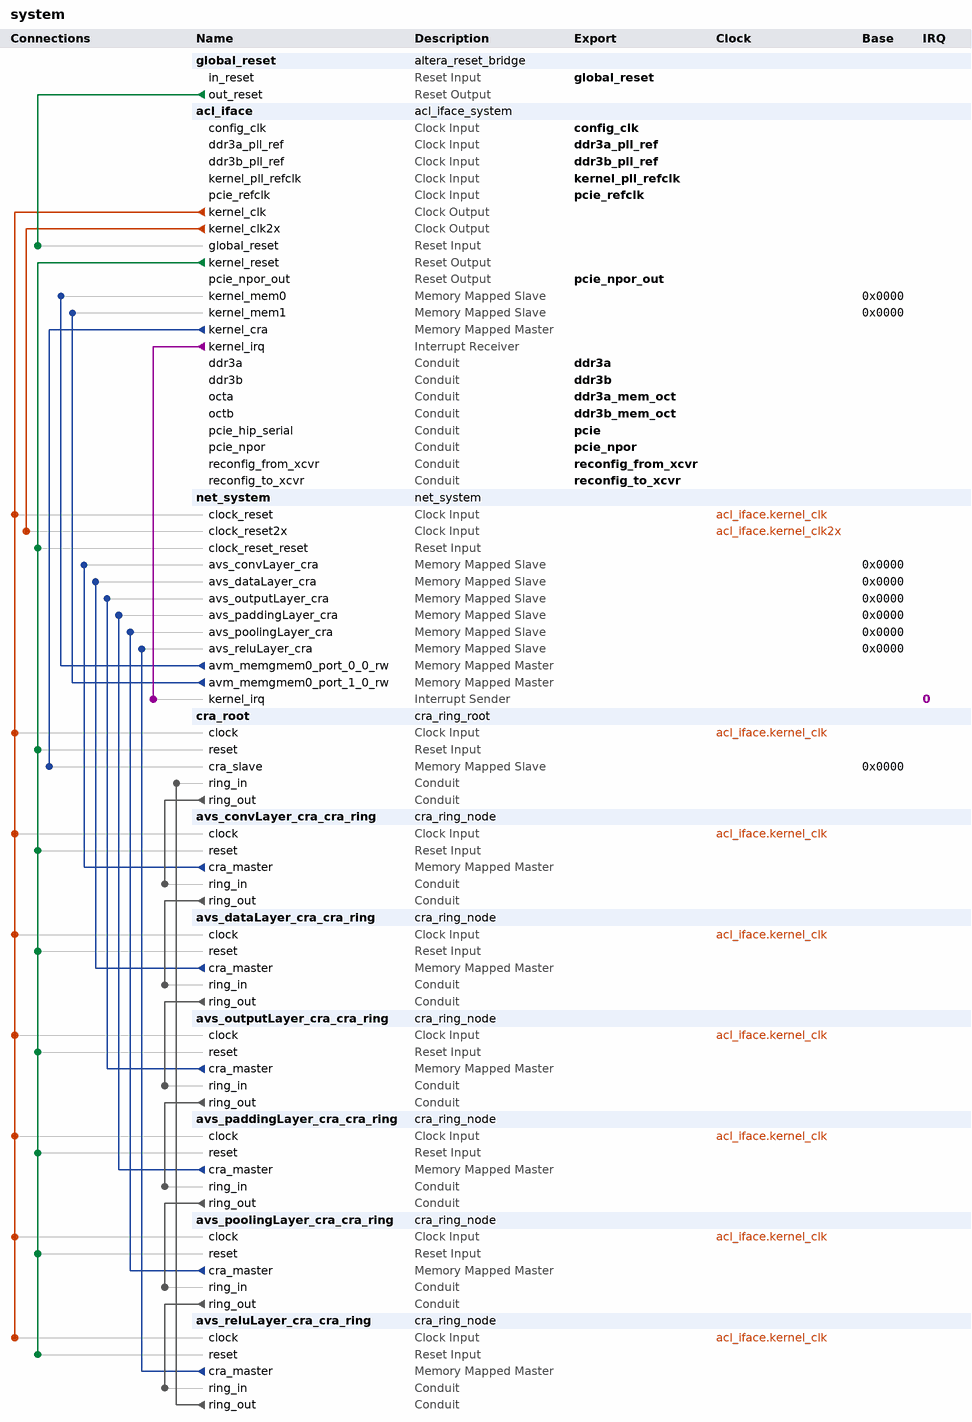
[diagram p0: system contents]
# Platform Designer (Qsys) system system, Stratix V 5SGXEA7N2F45C2
# Parameters at their usual value, and those the tool derives, are not listed.
package require -exact qsys 16.1
create_system system
set_project_property DEVICE_FAMILY {Stratix V}
set_project_property DEVICE 5SGXEA7N2F45C2

add_instance global_reset altera_reset_bridge 16.1
set_instance_parameter_value global_reset ACTIVE_LOW_RESET 1
set_instance_parameter_value global_reset SYNCHRONOUS_EDGES none

add_instance acl_iface acl_iface_system 1.0

add_instance net_system net_system 14.0

add_instance cra_root cra_ring_root 1.0
set_instance_parameter_value cra_root ADDR_W 5
set_instance_parameter_value cra_root DATA_W 64
set_instance_parameter_value cra_root ID_W 3
set_instance_parameter_value cra_root ROM_ENABLE 0
set_instance_parameter_value cra_root ROM_EXT_W 0

add_instance avs_convLayer_cra_cra_ring cra_ring_node 1.0
set_instance_parameter_value avs_convLayer_cra_cra_ring CRA_ADDR_W 5
set_instance_parameter_value avs_convLayer_cra_cra_ring DATA_W 64
set_instance_parameter_value avs_convLayer_cra_cra_ring ID 0
set_instance_parameter_value avs_convLayer_cra_cra_ring ID_W 3
set_instance_parameter_value avs_convLayer_cra_cra_ring RING_ADDR_W 5

add_instance avs_dataLayer_cra_cra_ring cra_ring_node 1.0
set_instance_parameter_value avs_dataLayer_cra_cra_ring CRA_ADDR_W 5
set_instance_parameter_value avs_dataLayer_cra_cra_ring DATA_W 64
set_instance_parameter_value avs_dataLayer_cra_cra_ring ID 1
set_instance_parameter_value avs_dataLayer_cra_cra_ring ID_W 3
set_instance_parameter_value avs_dataLayer_cra_cra_ring RING_ADDR_W 5

add_instance avs_outputLayer_cra_cra_ring cra_ring_node 1.0
set_instance_parameter_value avs_outputLayer_cra_cra_ring CRA_ADDR_W 5
set_instance_parameter_value avs_outputLayer_cra_cra_ring DATA_W 64
set_instance_parameter_value avs_outputLayer_cra_cra_ring ID 2
set_instance_parameter_value avs_outputLayer_cra_cra_ring ID_W 3
set_instance_parameter_value avs_outputLayer_cra_cra_ring RING_ADDR_W 5

add_instance avs_paddingLayer_cra_cra_ring cra_ring_node 1.0
set_instance_parameter_value avs_paddingLayer_cra_cra_ring CRA_ADDR_W 5
set_instance_parameter_value avs_paddingLayer_cra_cra_ring DATA_W 64
set_instance_parameter_value avs_paddingLayer_cra_cra_ring ID 3
set_instance_parameter_value avs_paddingLayer_cra_cra_ring ID_W 3
set_instance_parameter_value avs_paddingLayer_cra_cra_ring RING_ADDR_W 5

add_instance avs_poolingLayer_cra_cra_ring cra_ring_node 1.0
set_instance_parameter_value avs_poolingLayer_cra_cra_ring CRA_ADDR_W 5
set_instance_parameter_value avs_poolingLayer_cra_cra_ring DATA_W 64
set_instance_parameter_value avs_poolingLayer_cra_cra_ring ID 4
set_instance_parameter_value avs_poolingLayer_cra_cra_ring ID_W 3
set_instance_parameter_value avs_poolingLayer_cra_cra_ring RING_ADDR_W 5

add_instance avs_reluLayer_cra_cra_ring cra_ring_node 1.0
set_instance_parameter_value avs_reluLayer_cra_cra_ring CRA_ADDR_W 5
set_instance_parameter_value avs_reluLayer_cra_cra_ring DATA_W 64
set_instance_parameter_value avs_reluLayer_cra_cra_ring ID 5
set_instance_parameter_value avs_reluLayer_cra_cra_ring ID_W 3
set_instance_parameter_value avs_reluLayer_cra_cra_ring RING_ADDR_W 5

# connections
add_connection acl_iface.kernel_clk avs_convLayer_cra_cra_ring.clock clock
add_connection acl_iface.kernel_clk avs_dataLayer_cra_cra_ring.clock clock
add_connection acl_iface.kernel_clk avs_outputLayer_cra_cra_ring.clock clock
add_connection acl_iface.kernel_clk avs_paddingLayer_cra_cra_ring.clock clock
add_connection acl_iface.kernel_clk avs_poolingLayer_cra_cra_ring.clock clock
add_connection acl_iface.kernel_clk avs_reluLayer_cra_cra_ring.clock clock
add_connection acl_iface.kernel_clk cra_root.clock clock
add_connection acl_iface.kernel_clk net_system.clock_reset clock
add_connection acl_iface.kernel_clk2x net_system.clock_reset2x clock
add_connection acl_iface.kernel_reset avs_convLayer_cra_cra_ring.reset reset
add_connection acl_iface.kernel_reset avs_dataLayer_cra_cra_ring.reset reset
add_connection acl_iface.kernel_reset avs_outputLayer_cra_cra_ring.reset reset
add_connection acl_iface.kernel_reset avs_paddingLayer_cra_cra_ring.reset reset
add_connection acl_iface.kernel_reset avs_poolingLayer_cra_cra_ring.reset reset
add_connection acl_iface.kernel_reset avs_reluLayer_cra_cra_ring.reset reset
add_connection acl_iface.kernel_reset cra_root.reset reset
add_connection acl_iface.kernel_reset net_system.clock_reset_reset reset
add_connection global_reset.out_reset acl_iface.global_reset reset
add_connection acl_iface.kernel_cra cra_root.cra_slave avalon
set_connection_parameter_value acl_iface.kernel_cra/cra_root.cra_slave baseAddress 0x0000
add_connection avs_convLayer_cra_cra_ring.cra_master net_system.avs_convLayer_cra avalon
set_connection_parameter_value avs_convLayer_cra_cra_ring.cra_master/net_system.avs_convLayer_cra baseAddress 0x0000
add_connection avs_dataLayer_cra_cra_ring.cra_master net_system.avs_dataLayer_cra avalon
set_connection_parameter_value avs_dataLayer_cra_cra_ring.cra_master/net_system.avs_dataLayer_cra baseAddress 0x0000
add_connection avs_outputLayer_cra_cra_ring.cra_master net_system.avs_outputLayer_cra avalon
set_connection_parameter_value avs_outputLayer_cra_cra_ring.cra_master/net_system.avs_outputLayer_cra baseAddress 0x0000
add_connection avs_paddingLayer_cra_cra_ring.cra_master net_system.avs_paddingLayer_cra avalon
set_connection_parameter_value avs_paddingLayer_cra_cra_ring.cra_master/net_system.avs_paddingLayer_cra baseAddress 0x0000
add_connection avs_poolingLayer_cra_cra_ring.cra_master net_system.avs_poolingLayer_cra avalon
set_connection_parameter_value avs_poolingLayer_cra_cra_ring.cra_master/net_system.avs_poolingLayer_cra baseAddress 0x0000
add_connection avs_reluLayer_cra_cra_ring.cra_master net_system.avs_reluLayer_cra avalon
set_connection_parameter_value avs_reluLayer_cra_cra_ring.cra_master/net_system.avs_reluLayer_cra baseAddress 0x0000
add_connection net_system.avm_memgmem0_port_0_0_rw acl_iface.kernel_mem0 avalon
set_connection_parameter_value net_system.avm_memgmem0_port_0_0_rw/acl_iface.kernel_mem0 baseAddress 0x0000
add_connection net_system.avm_memgmem0_port_1_0_rw acl_iface.kernel_mem1 avalon
set_connection_parameter_value net_system.avm_memgmem0_port_1_0_rw/acl_iface.kernel_mem1 baseAddress 0x0000
add_connection avs_convLayer_cra_cra_ring.ring_out avs_dataLayer_cra_cra_ring.ring_in conduit
add_connection avs_dataLayer_cra_cra_ring.ring_out avs_outputLayer_cra_cra_ring.ring_in conduit
add_connection avs_outputLayer_cra_cra_ring.ring_out avs_paddingLayer_cra_cra_ring.ring_in conduit
add_connection avs_paddingLayer_cra_cra_ring.ring_out avs_poolingLayer_cra_cra_ring.ring_in conduit
add_connection avs_poolingLayer_cra_cra_ring.ring_out avs_reluLayer_cra_cra_ring.ring_in conduit
add_connection avs_reluLayer_cra_cra_ring.ring_out cra_root.ring_in conduit
add_connection cra_root.ring_out avs_convLayer_cra_cra_ring.ring_in conduit
add_connection acl_iface.kernel_irq net_system.kernel_irq interrupt
set_connection_parameter_value acl_iface.kernel_irq/net_system.kernel_irq irqNumber 0

# exported interfaces
add_interface config_clk clock sink
set_interface_property config_clk EXPORT_OF acl_iface.config_clk
add_interface ddr3a conduit end
set_interface_property ddr3a EXPORT_OF acl_iface.ddr3a
add_interface ddr3a_mem_oct conduit end
set_interface_property ddr3a_mem_oct EXPORT_OF acl_iface.octa
add_interface ddr3a_pll_ref clock sink
set_interface_property ddr3a_pll_ref EXPORT_OF acl_iface.ddr3a_pll_ref
add_interface ddr3b conduit end
set_interface_property ddr3b EXPORT_OF acl_iface.ddr3b
add_interface ddr3b_mem_oct conduit end
set_interface_property ddr3b_mem_oct EXPORT_OF acl_iface.octb
add_interface ddr3b_pll_ref clock sink
set_interface_property ddr3b_pll_ref EXPORT_OF acl_iface.ddr3b_pll_ref
add_interface global_reset reset sink
set_interface_property global_reset EXPORT_OF global_reset.in_reset
add_interface kernel_pll_refclk clock sink
set_interface_property kernel_pll_refclk EXPORT_OF acl_iface.kernel_pll_refclk
add_interface pcie conduit end
set_interface_property pcie EXPORT_OF acl_iface.pcie_hip_serial
add_interface pcie_npor conduit end
set_interface_property pcie_npor EXPORT_OF acl_iface.pcie_npor
add_interface pcie_npor_out reset source
set_interface_property pcie_npor_out EXPORT_OF acl_iface.pcie_npor_out
add_interface pcie_refclk clock sink
set_interface_property pcie_refclk EXPORT_OF acl_iface.pcie_refclk
add_interface reconfig_from_xcvr conduit end
set_interface_property reconfig_from_xcvr EXPORT_OF acl_iface.reconfig_from_xcvr
add_interface reconfig_to_xcvr conduit end
set_interface_property reconfig_to_xcvr EXPORT_OF acl_iface.reconfig_to_xcvr

set_interconnect_requirement {$system} qsys_mm.clockCrossingAdapter FIFO
set_interconnect_requirement {$system} qsys_mm.maxAdditionalLatency 0

save_system system.qsys
